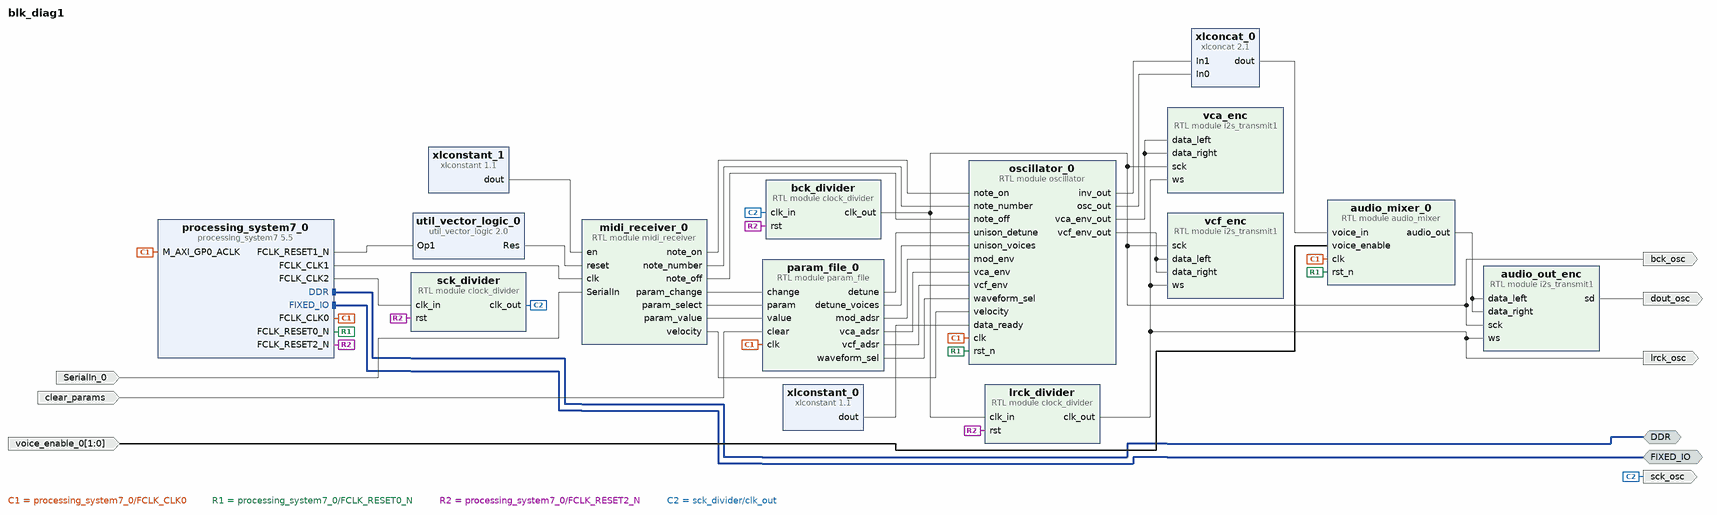
[diagram p0: block diagram of the top level]
# Vivado block design blk_diag1, xc7z020clg400-1, Vivado 2021.1
create_bd_design blk_diag1

create_bd_intf_port -mode Master -vlnv xilinx.com:interface:ddrx_rtl:1.0 DDR
create_bd_intf_port -mode Master -vlnv xilinx.com:display_processing_system7:fixedio_rtl:1.0 FIXED_IO
create_bd_port -dir I -from 1 -to 0 voice_enable_0
create_bd_port -dir O -type clk sck_osc
create_bd_port -dir O -type clk bck_osc
create_bd_port -dir O -type clk lrck_osc
create_bd_port -dir O -type data dout_osc
create_bd_port -dir I -type rst clear_params
set_property -dict {CONFIG.POLARITY ACTIVE_HIGH} [get_bd_ports clear_params]
create_bd_port -dir I SerialIn_0

create_bd_cell -type module -reference audio_mixer audio_mixer_0
set_property -dict {CONFIG.VOICE_COUNT 2} [get_bd_cells audio_mixer_0]
create_bd_cell -type module -reference i2s_transmit1 audio_out_enc
create_bd_cell -type module -reference clock_divider sck_divider
set_property -dict {CONFIG.DIVISOR 8} [get_bd_cells sck_divider]
create_bd_cell -type module -reference clock_divider lrck_divider
set_property -dict {CONFIG.DIVISOR 64} [get_bd_cells lrck_divider]
create_bd_cell -type module -reference i2s_transmit1 vca_enc
create_bd_cell -type module -reference i2s_transmit1 vcf_enc
create_bd_cell -type module -reference clock_divider bck_divider
set_property -dict {CONFIG.DIVISOR 2} [get_bd_cells bck_divider]
create_bd_cell -type ip -vlnv xilinx.com:ip:processing_system7:5.5 processing_system7_0
set_property -dict [list \
  CONFIG.PCW_APU_PERIPHERAL_FREQMHZ 666.666666 \
  CONFIG.PCW_DUAL_STACK_QSPI_DATA_MODE x4 \
  CONFIG.PCW_ENET0_ENET0_IO {MIO 16 .. 27} \
  CONFIG.PCW_ENET0_GRP_MDIO_ENABLE 1 \
  CONFIG.PCW_ENET0_GRP_MDIO_IO {MIO 52 .. 53} \
  CONFIG.PCW_ENET0_PERIPHERAL_CLKSRC {ARM PLL} \
  CONFIG.PCW_ENET0_PERIPHERAL_ENABLE 1 \
  CONFIG.PCW_ENET0_RESET_ENABLE 0 \
  CONFIG.PCW_ENET_RESET_ENABLE 1 \
  CONFIG.PCW_ENET_RESET_SELECT {Share reset pin} \
  CONFIG.PCW_EN_CLK1_PORT 1 \
  CONFIG.PCW_EN_CLK2_PORT 1 \
  CONFIG.PCW_EN_RST1_PORT 1 \
  CONFIG.PCW_EN_RST2_PORT 1 \
  CONFIG.PCW_FCLK_CLK1_BUF TRUE \
  CONFIG.PCW_FPGA0_PERIPHERAL_FREQMHZ 100 \
  CONFIG.PCW_FPGA1_PERIPHERAL_FREQMHZ 1 \
  CONFIG.PCW_FPGA2_PERIPHERAL_FREQMHZ 25 \
  CONFIG.PCW_FPGA_FCLK1_ENABLE 1 \
  CONFIG.PCW_FPGA_FCLK2_ENABLE 1 \
  CONFIG.PCW_GPIO_MIO_GPIO_ENABLE 1 \
  CONFIG.PCW_GPIO_MIO_GPIO_IO MIO \
  CONFIG.PCW_GPIO_PERIPHERAL_ENABLE 1 \
  CONFIG.PCW_I2C_RESET_ENABLE 0 \
  CONFIG.PCW_PERIPHERAL_BOARD_PRESET part0 \
  CONFIG.PCW_PRESET_BANK1_VOLTAGE {HSTL 1.8V} \
  CONFIG.PCW_QSPI_GRP_FBCLK_ENABLE 1 \
  CONFIG.PCW_QSPI_GRP_FBCLK_IO {MIO 8} \
  CONFIG.PCW_QSPI_GRP_SINGLE_SS_ENABLE 0 \
  CONFIG.PCW_QSPI_GRP_SS1_ENABLE 1 \
  CONFIG.PCW_QSPI_GRP_SS1_IO {MIO 0} \
  CONFIG.PCW_QSPI_INTERNAL_HIGHADDRESS 0xFDFFFFFF \
  CONFIG.PCW_QSPI_PERIPHERAL_ENABLE 1 \
  CONFIG.PCW_QSPI_QSPI_IO {MIO 1 .. 6} \
  CONFIG.PCW_SD0_GRP_CD_ENABLE 1 \
  CONFIG.PCW_SD0_GRP_CD_IO {MIO 46} \
  CONFIG.PCW_SD0_GRP_WP_ENABLE 1 \
  CONFIG.PCW_SD0_GRP_WP_IO {MIO 47} \
  CONFIG.PCW_SD0_PERIPHERAL_ENABLE 1 \
  CONFIG.PCW_SD0_SD0_IO {MIO 40 .. 45} \
  CONFIG.PCW_SDIO_PERIPHERAL_FREQMHZ 100 \
  CONFIG.PCW_UART0_PERIPHERAL_ENABLE 1 \
  CONFIG.PCW_UART0_UART0_IO {MIO 10 .. 11} \
  CONFIG.PCW_UART1_PERIPHERAL_ENABLE 0 \
  CONFIG.PCW_UART_PERIPHERAL_FREQMHZ 100 \
  CONFIG.PCW_UIPARAM_DDR_FREQ_MHZ 533.333333 \
  CONFIG.PCW_UIPARAM_DDR_PARTNO {MT41J256M16 RE-125} \
  CONFIG.PCW_USB0_PERIPHERAL_ENABLE 1 \
  CONFIG.PCW_USB0_RESET_ENABLE 0 \
  CONFIG.PCW_USB0_USB0_IO {MIO 28 .. 39} \
  CONFIG.PCW_USB_RESET_ENABLE 1 \
  CONFIG.PCW_USB_RESET_SELECT {Share reset pin} \
] [get_bd_cells processing_system7_0]
# 492 more settings of processing_system7_0 are not shown: defaults, MIO pin electricals, DDR timing, and values the tool derives
create_bd_cell -type ip -vlnv xilinx.com:ip:util_vector_logic:2.0 util_vector_logic_0
set_property -dict {CONFIG.C_OPERATION not CONFIG.C_SIZE 1} [get_bd_cells util_vector_logic_0]
create_bd_cell -type ip -vlnv xilinx.com:ip:xlconcat:2.1 xlconcat_0
set_property -dict {CONFIG.IN0_WIDTH 24 CONFIG.IN1_WIDTH 24 CONFIG.dout_width 48} [get_bd_cells xlconcat_0]
create_bd_cell -type ip -vlnv xilinx.com:ip:xlconstant:1.1 xlconstant_0
create_bd_cell -type ip -vlnv xilinx.com:ip:xlconstant:1.1 xlconstant_1
create_bd_cell -type module -reference midi_receiver midi_receiver_0
create_bd_cell -type module -reference oscillator oscillator_0
create_bd_cell -type module -reference param_file param_file_0

# ---- connections ----

connect_bd_intf_net [get_bd_intf_ports DDR] [get_bd_intf_pins processing_system7_0/DDR]
connect_bd_intf_net [get_bd_intf_ports FIXED_IO] [get_bd_intf_pins processing_system7_0/FIXED_IO]
connect_bd_net [get_bd_pins midi_receiver_0/note_on] [get_bd_pins oscillator_0/note_on]
connect_bd_net -net SerialIn_0_1 [get_bd_ports SerialIn_0] [get_bd_pins midi_receiver_0/SerialIn]
connect_bd_net [get_bd_pins audio_mixer_0/audio_out] [get_bd_pins audio_out_enc/data_left] [get_bd_pins audio_out_enc/data_right]
connect_bd_net [get_bd_pins audio_out_enc/sd] [get_bd_ports dout_osc]
connect_bd_net [get_bd_ports clear_params] [get_bd_pins param_file_0/clear]
connect_bd_net -net clock_divider_3_clk_out [get_bd_pins lrck_divider/clk_out] \
  [get_bd_pins audio_out_enc/ws] [get_bd_pins vca_enc/ws] [get_bd_pins vcf_enc/ws] [get_bd_ports lrck_osc]
connect_bd_net -net clock_divider_4_clk_out [get_bd_pins bck_divider/clk_out] \
  [get_bd_pins lrck_divider/clk_in] [get_bd_ports bck_osc] [get_bd_pins vcf_enc/sck] [get_bd_pins vca_enc/sck] \
  [get_bd_pins audio_out_enc/sck]
connect_bd_net [get_bd_pins midi_receiver_0/note_number] [get_bd_pins oscillator_0/note_number]
connect_bd_net [get_bd_pins midi_receiver_0/note_off] [get_bd_pins oscillator_0/note_off]
connect_bd_net [get_bd_pins midi_receiver_0/param_change] [get_bd_pins param_file_0/change]
connect_bd_net [get_bd_pins midi_receiver_0/param_select] [get_bd_pins param_file_0/param]
connect_bd_net [get_bd_pins midi_receiver_0/param_value] [get_bd_pins param_file_0/value]
connect_bd_net [get_bd_pins midi_receiver_0/velocity] [get_bd_pins oscillator_0/velocity]
connect_bd_net [get_bd_pins oscillator_0/inv_out] [get_bd_pins xlconcat_0/In1]
connect_bd_net [get_bd_pins oscillator_0/osc_out] [get_bd_pins xlconcat_0/In0]
connect_bd_net [get_bd_pins oscillator_0/vca_env_out] [get_bd_pins vca_enc/data_left] [get_bd_pins vca_enc/data_right]
connect_bd_net [get_bd_pins oscillator_0/vcf_env_out] [get_bd_pins vcf_enc/data_left] [get_bd_pins vcf_enc/data_right]
connect_bd_net [get_bd_pins param_file_0/detune] [get_bd_pins oscillator_0/unison_detune]
connect_bd_net [get_bd_pins param_file_0/detune_voices] [get_bd_pins oscillator_0/unison_voices]
connect_bd_net [get_bd_pins param_file_0/mod_adsr] [get_bd_pins oscillator_0/mod_env]
connect_bd_net [get_bd_pins param_file_0/vca_adsr] [get_bd_pins oscillator_0/vca_env]
connect_bd_net [get_bd_pins param_file_0/vcf_adsr] [get_bd_pins oscillator_0/vcf_env]
connect_bd_net [get_bd_pins param_file_0/waveform_sel] [get_bd_pins oscillator_0/waveform_sel]
connect_bd_net [get_bd_pins processing_system7_0/FCLK_CLK0] \
  [get_bd_pins audio_mixer_0/clk] [get_bd_pins processing_system7_0/M_AXI_GP0_ACLK] [get_bd_pins oscillator_0/clk] \
  [get_bd_pins param_file_0/clk]
connect_bd_net [get_bd_pins processing_system7_0/FCLK_CLK1] [get_bd_pins midi_receiver_0/clk]
connect_bd_net [get_bd_pins processing_system7_0/FCLK_CLK2] [get_bd_pins sck_divider/clk_in]
connect_bd_net [get_bd_pins processing_system7_0/FCLK_RESET0_N] [get_bd_pins audio_mixer_0/rst_n] [get_bd_pins oscillator_0/rst_n]
connect_bd_net [get_bd_pins processing_system7_0/FCLK_RESET1_N] [get_bd_pins util_vector_logic_0/Op1]
connect_bd_net [get_bd_pins processing_system7_0/FCLK_RESET2_N] \
  [get_bd_pins sck_divider/rst] [get_bd_pins lrck_divider/rst] [get_bd_pins bck_divider/rst]
connect_bd_net -net sck_clk_out [get_bd_pins sck_divider/clk_out] [get_bd_pins bck_divider/clk_in] [get_bd_ports sck_osc]
connect_bd_net [get_bd_pins util_vector_logic_0/Res] [get_bd_pins midi_receiver_0/reset]
connect_bd_net -net voice_enable_0_1 [get_bd_ports voice_enable_0] [get_bd_pins audio_mixer_0/voice_enable]
connect_bd_net [get_bd_pins xlconcat_0/dout] [get_bd_pins audio_mixer_0/voice_in]
connect_bd_net [get_bd_pins xlconstant_0/dout] [get_bd_pins oscillator_0/data_ready]
connect_bd_net [get_bd_pins xlconstant_1/dout] [get_bd_pins midi_receiver_0/en]

validate_bd_design
save_bd_design
